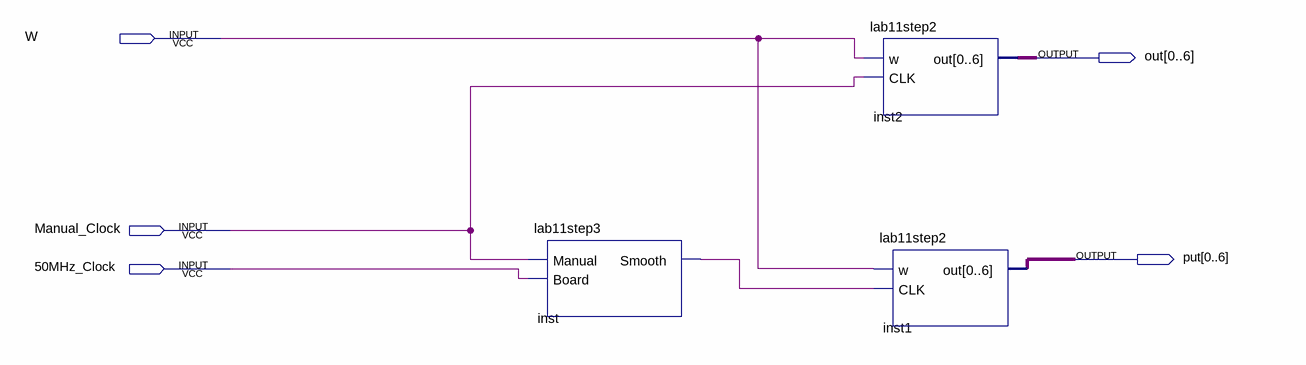
[diagram p0: schematic sheet]
// Quartus schematic lab11step4.bdf as structural Verilog: 3 symbols, 5 pins
module lab11step4 (
  input  W,
  input  Manual_Clock,
  input  \50MHz_Clock ,
  output [0:6] out,
  output [0:6] put
);

  wire inst_smooth;

  lab11step3 inst (.Manual(Manual_Clock), .Board(\50MHz_Clock ), .Smooth(inst_smooth));
  lab11step2 inst2 (.w(W), .CLK(Manual_Clock), .out(out));
  lab11step2 inst1 (.w(W), .CLK(inst_smooth), .out(put));
endmodule
